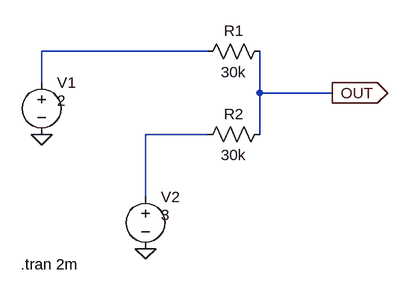
[diagram p0: schematic Voltage_summer1.asc]
Voltage_summer1.asc, the LTspice schematic file:
Version 4
SHEET 1 880 680
WIRE 160 96 -96 96
WIRE -96 144 -96 96
WIRE 240 160 240 96
WIRE 352 160 240 160
WIRE 160 224 64 224
WIRE 240 224 240 160
WIRE 64 320 64 224
FLAG -96 224 0
FLAG 64 400 0
FLAG 352 160 OUT
IOPIN 352 160 Out
SYMBOL res 256 80 R90
WINDOW 0 0 56 VBottom 2
WINDOW 3 32 56 VTop 2
SYMATTR InstName R1
SYMATTR Value 30k
SYMBOL res 256 208 R90
WINDOW 0 0 56 VBottom 2
WINDOW 3 32 56 VTop 2
SYMATTR InstName R2
SYMATTR Value 30k
SYMBOL voltage -96 128 R0
WINDOW 3 24 44 Left 2
WINDOW 123 0 0 Left 0
WINDOW 39 0 0 Left 0
SYMATTR Value 2
SYMATTR InstName V1
SYMBOL voltage 64 304 R0
WINDOW 3 24 44 Left 2
WINDOW 123 0 0 Left 0
WINDOW 39 0 0 Left 0
SYMATTR Value 3
SYMATTR InstName V2
TEXT -128 424 Left 2 !.tran 2m

The netlist it stands for:
* Voltage_summer1.asc
R1 OUT N001 30k
R2 OUT N002 30k
V1 N001 0 2
V2 N002 0 3
.tran 2m
.backanno
.end